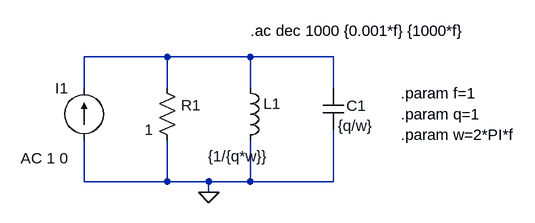
[diagram p0: schematic CircuitoRLC.asc]
CircuitoRLC.asc, the LTspice schematic file:
Version 4
SHEET 1 880 680
WIRE 96 64 -32 64
WIRE 224 64 96 64
WIRE 352 64 224 64
WIRE -32 112 -32 64
WIRE 96 112 96 64
WIRE 224 112 224 64
WIRE 352 112 352 64
WIRE -32 256 -32 192
WIRE 96 256 96 192
WIRE 96 256 -32 256
WIRE 160 256 96 256
WIRE 224 256 224 192
WIRE 224 256 160 256
WIRE 352 256 352 176
WIRE 352 256 224 256
WIRE 160 272 160 256
FLAG 160 272 0
SYMBOL res 80 96 R0
WINDOW 0 37 42 Left 2
WINDOW 3 -19 80 Left 2
SYMATTR InstName R1
SYMATTR Value 1
SYMBOL ind 208 96 R0
WINDOW 3 -49 121 Left 2
SYMATTR InstName L1
SYMATTR Value {1/{q*w}}
SYMBOL cap 336 112 R0
WINDOW 0 36 27 Left 2
WINDOW 3 23 58 Left 2
SYMATTR InstName C1
SYMATTR Value {q/w}
SYMBOL current -32 192 R180
WINDOW 0 24 80 Left 2
WINDOW 3 24 0 Left 2
WINDOW 123 24 -28 Left 2
WINDOW 39 0 0 Left 0
SYMATTR InstName I1
SYMATTR Value ""
SYMATTR Value2 AC 1 0
TEXT 224 24 Left 2 !.ac dec 1000 {0.001*f} {1000*f}
TEXT 456 120 Left 2 !.param f=1
TEXT 456 152 Left 2 !.param q=1
TEXT 456 184 Left 2 !.param w=2*PI*f

The netlist it stands for:
* CircuitoRLC.asc
R1 N001 0 1
L1 N001 0 {1/{q*w}}
C1 N001 0 {q/w}
I1 0 N001 AC 1 0
.ac dec 1000 {0.001*f} {1000*f}
.param f=1
.param q=1
.param w=2*PI*f
.backanno
.end